# Altium schematic sheet 14-FPGA-01a.SchDoc
size Tabloid; Customer: 01910; SheetNumber: 14; SheetTotal: 20
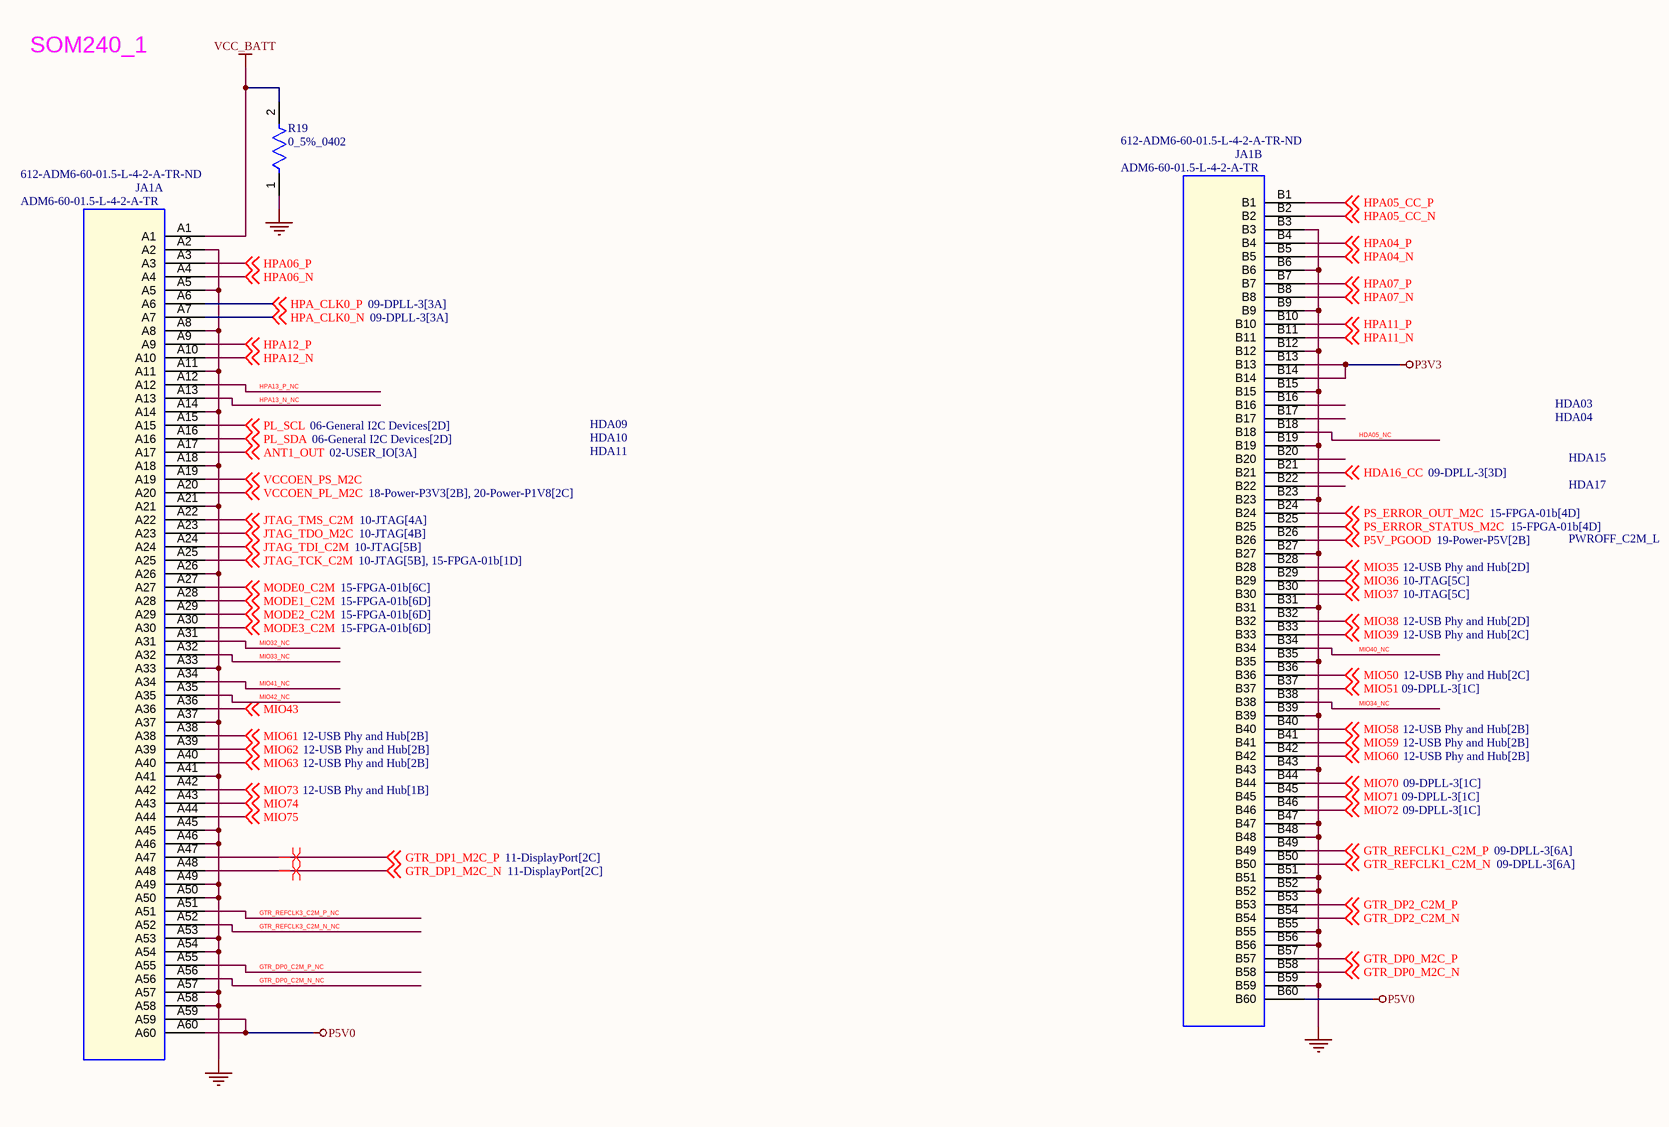
[diagram p0: 14-FPGA-01a.SchDoc]

## Parts
JA1  ADM6-60-01.5-L-4-2-A-TR  Supplier Part Number 1: 612-ADM6-60-01.5-L-4-2-A-TR-ND  [CON_SAMTEC_ADM6_60_4]  (parts A,B of 4)
R19  0_5%_0402  [FP-AC0402-0_37-IPC_B]

## Nets
GND: JA1.A2 JA1.A5 JA1.A8 JA1.A11 JA1.A14 JA1.A18 JA1.A21 JA1.A26 JA1.A33 JA1.A37 JA1.A41 JA1.A45 JA1.A46 JA1.A49 JA1.A50 JA1.A53 JA1.A54 JA1.A57 JA1.A58 JA1.B3 JA1.B6 JA1.B9 JA1.B12 JA1.B15 JA1.B19 JA1.B23 JA1.B27 JA1.B31 JA1.B35 JA1.B39 JA1.B43 JA1.B47 JA1.B48 JA1.B51 JA1.B52 JA1.B55 JA1.B56 JA1.B59 R19.1
P3V3: JA1.B13 JA1.B14
P5V0: JA1.A59 JA1.A60 JA1.B60
VCC_BATT: JA1.A1 R19.2
ANT1_OUT: JA1.A17 ; off-sheet ANT1_OUT
GTR_DP0_C2M_N_NC: JA1.A56
GTR_DP0_C2M_P_NC: JA1.A55
GTR_DP0_M2C_N: JA1.B58 ; off-sheet GTR_DP0_M2C_N
GTR_DP0_M2C_P: JA1.B57 ; off-sheet GTR_DP0_M2C_P
GTR_DP1_M2C_N: JA1.A48 ; off-sheet GTR_DP1_M2C_N
GTR_DP1_M2C_P: JA1.A47 ; off-sheet GTR_DP1_M2C_P
GTR_DP2_C2M_N: JA1.B54 ; off-sheet GTR_DP2_C2M_N
GTR_DP2_C2M_P: JA1.B53 ; off-sheet GTR_DP2_C2M_P
GTR_REFCLK1_C2M_N: JA1.B50 ; off-sheet GTR_REFCLK1_C2M_N
GTR_REFCLK1_C2M_P: JA1.B49 ; off-sheet GTR_REFCLK1_C2M_P
GTR_REFCLK3_C2M_N_NC: JA1.A52
GTR_REFCLK3_C2M_P_NC: JA1.A51
HDA05_NC: JA1.B18
HDA16_CC: JA1.B21 ; off-sheet HDA16_CC
HPA04_N: JA1.B5 ; off-sheet HPA04_N
HPA04_P: JA1.B4 ; off-sheet HPA04_P
HPA05_CC_N: JA1.B2 ; off-sheet HPA05_CC_N
HPA05_CC_P: JA1.B1 ; off-sheet HPA05_CC_P
HPA06_N: JA1.A4 ; off-sheet HPA06_N
HPA06_P: JA1.A3 ; off-sheet HPA06_P
HPA07_N: JA1.B8 ; off-sheet HPA07_N
HPA07_P: JA1.B7 ; off-sheet HPA07_P
HPA11_N: JA1.B11 ; off-sheet HPA11_N
HPA11_P: JA1.B10 ; off-sheet HPA11_P
HPA12_N: JA1.A10 ; off-sheet HPA12_N
HPA12_P: JA1.A9 ; off-sheet HPA12_P
HPA13_N_NC: JA1.A13
HPA13_P_NC: JA1.A12
HPA_CLK0_N: JA1.A7 ; off-sheet HPA_CLK0_N
HPA_CLK0_P: JA1.A6 ; off-sheet HPA_CLK0_P
JTAG_TCK_C2M: JA1.A25 ; off-sheet JTAG_TCK_C2M
JTAG_TDI_C2M: JA1.A24 ; off-sheet JTAG_TDI_C2M
JTAG_TDO_M2C: JA1.A23 ; off-sheet JTAG_TDO_M2C
JTAG_TMS_C2M: JA1.A22 ; off-sheet JTAG_TMS_C2M
MIO32_NC: JA1.A31
MIO33_NC: JA1.A32
MIO34_NC: JA1.B38
MIO35: JA1.B28 ; off-sheet MIO35
MIO36: JA1.B29 ; off-sheet MIO36
MIO37: JA1.B30 ; off-sheet MIO37
MIO38: JA1.B32 ; off-sheet MIO38
MIO39: JA1.B33 ; off-sheet MIO39
MIO40_NC: JA1.B34
MIO41_NC: JA1.A34
MIO42_NC: JA1.A35
MIO43: JA1.A36 ; off-sheet MIO43
MIO50: JA1.B36 ; off-sheet MIO50
MIO51: JA1.B37 ; off-sheet MIO51
MIO58: JA1.B40 ; off-sheet MIO58
MIO59: JA1.B41 ; off-sheet MIO59
MIO60: JA1.B42 ; off-sheet MIO60
MIO61: JA1.A38 ; off-sheet MIO61
MIO62: JA1.A39 ; off-sheet MIO62
MIO63: JA1.A40 ; off-sheet MIO63
MIO70: JA1.B44 ; off-sheet MIO70
MIO71: JA1.B45 ; off-sheet MIO71
MIO72: JA1.B46 ; off-sheet MIO72
MIO73: JA1.A42 ; off-sheet MIO73
MIO74: JA1.A43 ; off-sheet MIO74
MIO75: JA1.A44 ; off-sheet MIO75
MODE0_C2M: JA1.A27 ; off-sheet MODE0_C2M
MODE1_C2M: JA1.A28 ; off-sheet MODE1_C2M
MODE2_C2M: JA1.A29 ; off-sheet MODE2_C2M
MODE3_C2M: JA1.A30 ; off-sheet MODE3_C2M
P5V_PGOOD: JA1.B26 ; off-sheet P5V_PGOOD
PL_SCL: JA1.A15 ; off-sheet PL_SCL
PL_SDA: JA1.A16 ; off-sheet PL_SDA
PS_ERROR_OUT_M2C: JA1.B24 ; off-sheet PS_ERROR_OUT_M2C
PS_ERROR_STATUS_M2C: JA1.B25 ; off-sheet PS_ERROR_STATUS_M2C
VCCOEN_PL_M2C: JA1.A20 ; off-sheet VCCOEN_PL_M2C
VCCOEN_PS_M2C: JA1.A19 ; off-sheet VCCOEN_PS_M2C

Not connected (* = marked no-connect by the designer): JA1 B16 B17 B20 B22

## Layout directives
differential pair: GTR_DP1_M2C_N, GTR_DP1_M2C_P

## Notes on the sheet
- SOM240_1
- HDA09
- HDA03
- HDA04
- HDA10
- HDA11
- HDA15
- HDA17
- PWROFF_C2M_L
- SHEET
- REV
- timingcard.com <http://timingcard.com>
- DATE
- OF

## Library data of the parts
JA1 = SAMTEC-ADx6-60X4: Conn Rcpt Male Vert 240 Pos 4x60 0.635mm P Black SMT; Manufacturer: Samtec Inc.; Agile Part Number: CON-00383-01; SPLIT_INST: TRUE; SWAP_INFO: (S1+S2+S3+S4); Pitch: 0.025" (0.64mm); Barcode: 40000092; Datasheet: http://suddendocs.samtec.com/catalog_english/adf6.pdf; Manufacturer PN: ADM6-60-01.5-L-4-2-A-TR; PCB Footprint: CON_SAMTEC_ADM6_60_4; CIP Link: http://xsjbrdwin1/CIP-E/Component/Index/All?pn=40000092; Number of Pins: 240; Part Type: CONNECTOR; Supplier 1: Digi-Key
R19 = CMP-2002-01772-2: RESISTOR 0402 JUMPER ZERO OHM; Voltage Rating: 50V; Temperature Coefficient: 200ppm/°C; Tolerance: 1%; Power Rating: 62.5mW; Resistance: 0R; Min Operating Temperature: -55°C; Termination: SMD/SMT; Case/Package: 0402; Case Code (Imperial): 0402; Packaging: Tape and Reel; Case Code (Metric): 1005; Max Operating Temperature: 155°C; Series: AC